# EAGLE design garbageSensor (EAGLE 6.4)
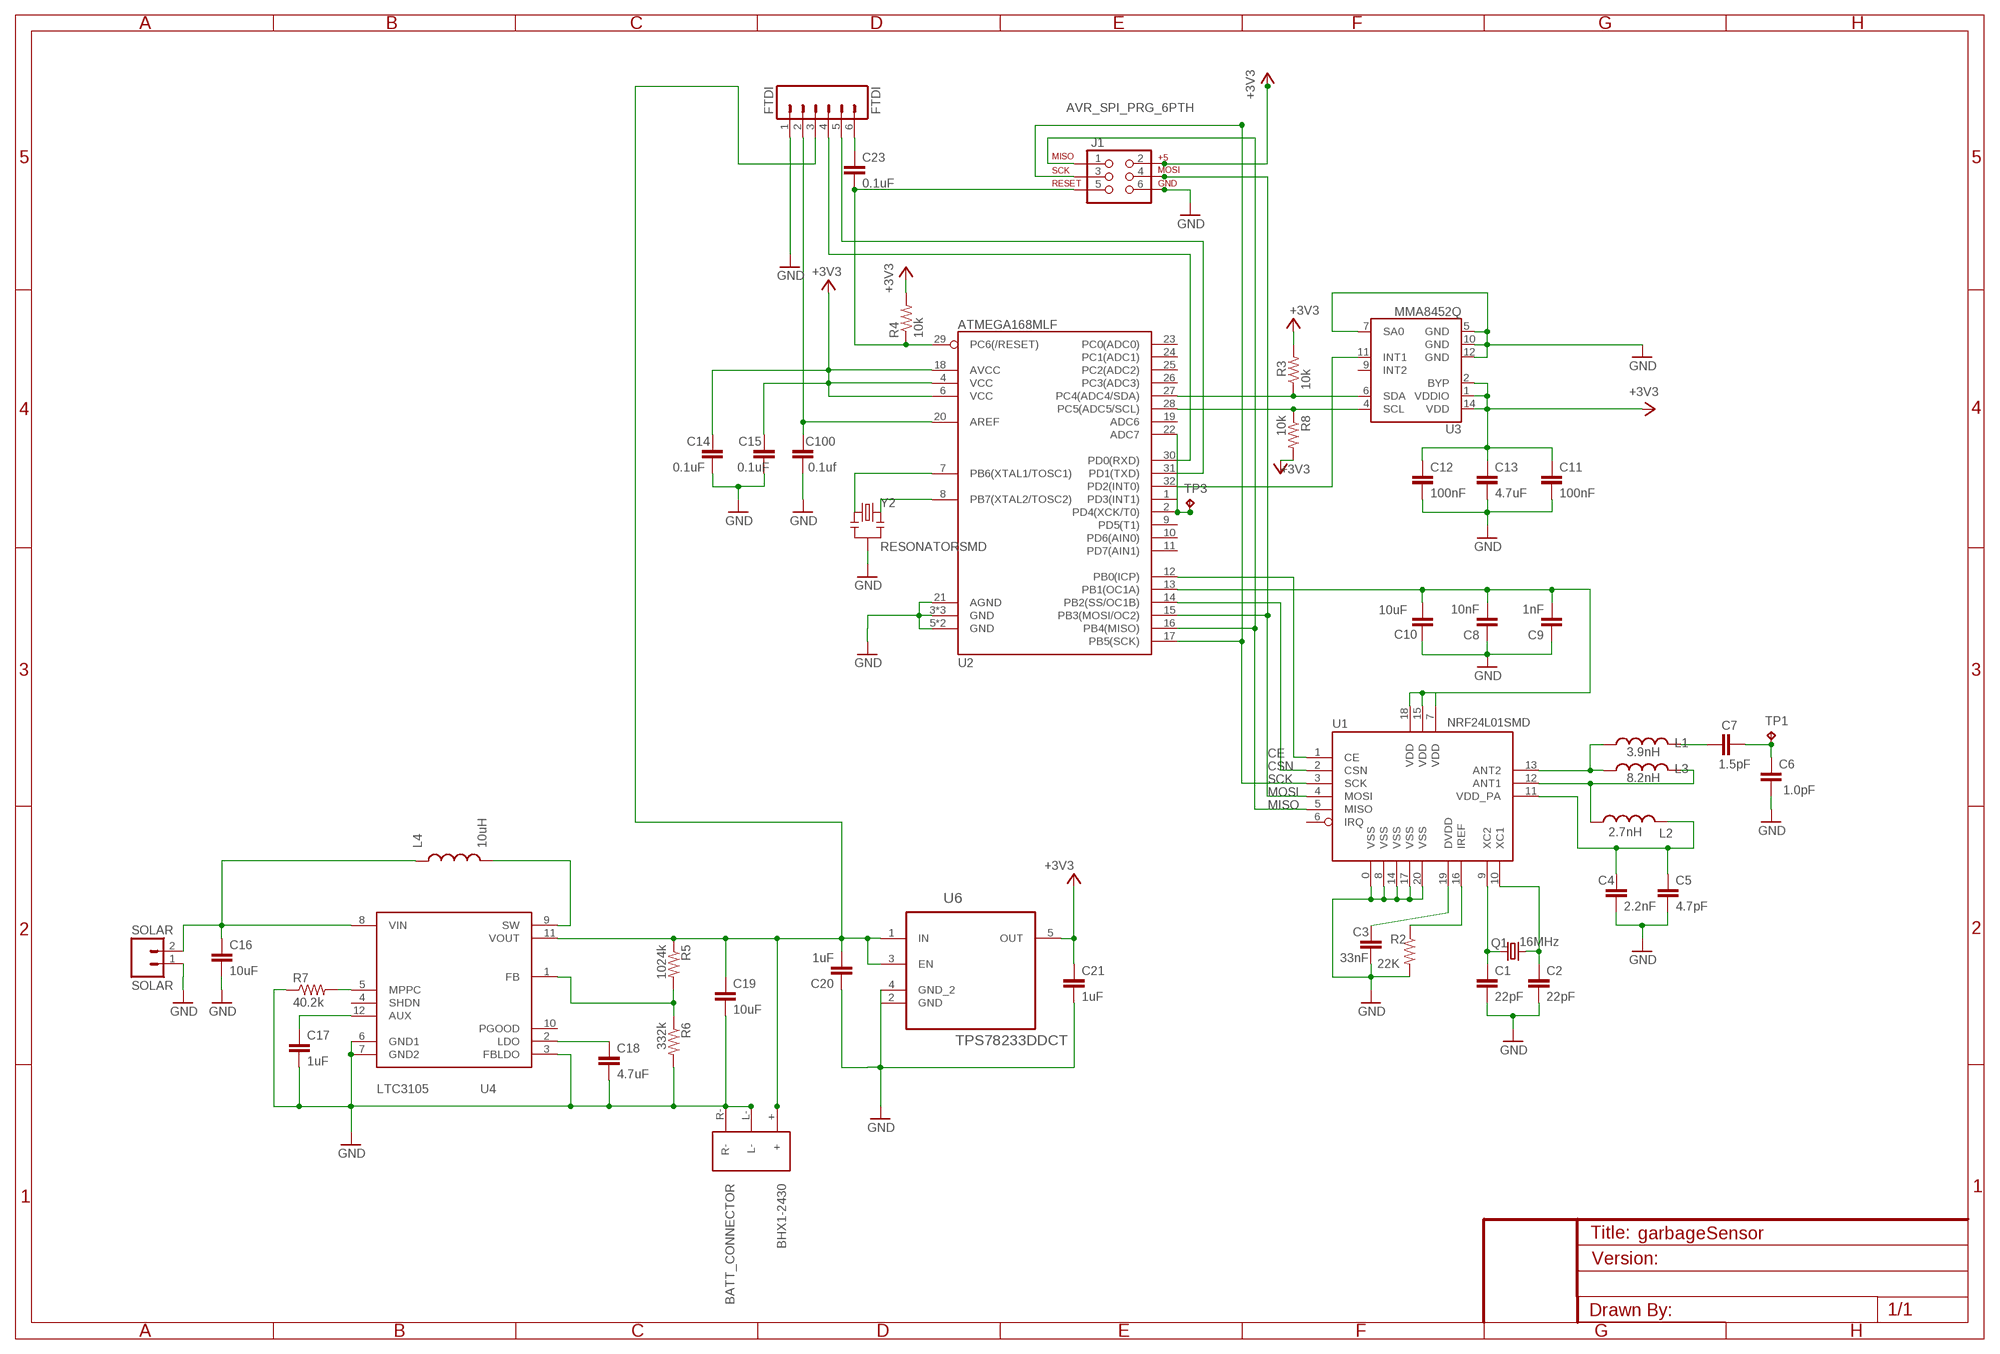
[diagram p0: schematic, sheet 1]

## Parts
B1  BATT_CONNECTOR  BHX1-2325  [BHX1-2325]
C1  22pF  CAP0603  [0603]
C2  22pF  CAP0603  [0603]
C3  33nF  CAP0603  [0603]
C4  2.2nF  CAP0402  [C0402]
C5  4.7pF  CAP0402  [C0402]
C6  1.0pF  CAP0402  [C0402]
C7  1.5pF  CAP0402  [C0402]
C8  10nF  CAP0603  [0603]
C9  1nF  CAP0603  [0603]
C10  10uF  C-EUC0603K  [C0603K]
C11  100nF  C-EUC0603K  [C0603K]
C12  100nF  C-EUC0603K  [C0603K]
C13  4.7uF  C-EUC0603K  [C0603K]
C14  0.1uF  C-EUC0603K  [C0603K]
C15  0.1uF  C-EUC0603K  [C0603K]
C16  10uF  C-EUC0603K  [C0603K]
C17  1uF  C-EUC0603K  [C0603K]
C18  4.7uF  C-EUC0603K  [C0603K]
C19  10uF  C-EUC0603K  [C0603K]
C20  1uF  C-EUC0603K  [C0603K]
C21  1uF  C-EUC0603K  [C0603K]
C23  0.1uF  CAP0603-CAP  [0603-CAP]
C100  0.1uf  CAP0603-CAP  [0603-CAP]
FTDI  FTDI  M06SIP  [1X06]
J1  AVR_SPI_PRG_6PTH  [2X3]
L1  3.9nH  INDUCTOR0402  [C0402]
L2  2.7nH  INDUCTOR0402  [C0402]
L3  8.2nH  INDUCTOR0402  [C0402]
L4  10uH  LQH2  [0806]
Q1  16MHz  CRYSTAL5X3  [CRYSTAL-SMD-5X3]
R2  22K  RESISTOR0603  [0603]
R3  10k  R-US_R0603  [R0603]
R4  10k  R-US_R0603  [R0603]
R5  1024k  R-US_R0603  [R0603]
R6  332k  R-US_R0603  [R0603]
R7  40.2k  R-US_R0603  [R0603]
R8  10k  R-US_R0603  [R0603]
SOLAR  SOLAR  M02LOCK  [1X02_LOCK]
TP1  TPB2,54  [B2,54]
TP3  TPTP06R  [TP06R]
U1  NRF24L01SMD  [QFN20]
U2  ATMEGA168MLF  [MLF32]
U3  MMA8452Q  [QFN-16_0.5MM]
U4  CHARGER  LTC3105  [MSOP-12]
U6  TPS78233DDCT  [SOT95P280X110-5N]
Y2  RESONATORSMD  [RESONATOR-SMD]

## Nets
+3V3: C11.1 C12.1 C13.1 C14.2 C15.2 C21.1 J1.2 R3.2 R4.2 R8.2 U2.4(VCC) U2.6(VCC) U2.18(AVCC) U3.1(VDDIO) U3.2(BYP) U3.14(VDD) U6.5(OUT)
ACCELERO_INTERRUPT: U2.32(PD2(INT0)) U3.11(INT1)
ANT: C6.2 C7.2 TP1.TP
ANTENNA1: L1.1 L3.1 U1.13(ANT2)
ANTENNA2: L2.1 L3.2 U1.12(ANT1)
ANTENNA3: C4.1 C5.1 L2.2 U1.11(VDD_PA)
AREF: C100.1 FTDI.2 U2.20(AREF)
AUX: C17.1 U4.12(AUX)
CE: U1.1(CE) U2.12(PB0(ICP))
CSN: U1.2(CSN) U2.14(PB2(SS/OC1B))
FB: R5.2 R6.1 U4.1(FB)
GND: B1.L- B1.R- C1.2 C2.2 C3.2 C4.2 C5.2 C6.1 C8.1 C9.1 C10.2 C11.2 C12.2 C13.2 C14.1 C15.1 C16.2 C17.2 C18.2 C19.2 C20.1 C21.2 C100.2 FTDI.1 J1.6 R2.2 R6.2 R7.1 SOLAR.1 U1.0(VSS) U1.8(VSS) U1.14(VSS) U1.17(VSS) U1.20(VSS) U2.3(GND) U2.5(GND) U2.21(AGND) U2.GND1(GND) U2.GND2(GND) U2.GND3(GND) U3.5(GND) U3.7(SA0) U3.10(GND) U3.12(GND) U4.3(FBLDO) U4.6(GND1) U4.7(GND2) U6.2(GND) U6.4(GND_2) Y2.2
LDO: C18.1 U4.2(LDO)
MISO: J1.1 U1.5(MISO) U2.16(PB4(MISO))
MOSI: J1.4 U1.4(MOSI) U2.15(PB3(MOSI/OC2))
MPPC: R7.2 U4.5(MPPC)
N$1: C1.1 Q1.1 U1.9(XC2)
N$2: C2.1 Q1.3 U1.10(XC1)
N$4: R2.1 U1.16(IREF)
N$5: C3.1 U1.19(DVDD)
N$6: TP3.TP U2.2(PD4(XCK/T0))
N$7: U2.22(ADC7)
N$9: C7.1 L1.2
N$11: L4.P$2 U4.9(SW)
N$12: C23.1 FTDI.6
RESET: C23.2 J1.5 R4.1 U2.29(PC6(/RESET))
RX: FTDI.4 U2.30(PD0(RXD))
SCK: J1.3 U1.3(SCK) U2.17(PB5(SCK))
SCL: R8.1 U2.28(PC5(ADC5/SCL)) U3.4(SCL)
SDA: R3.1 U2.27(PC4(ADC4/SDA)) U3.6(SDA)
SOLAR: C16.1 L4.P$1 SOLAR.2 U4.8(VIN)
TX: FTDI.5 U2.31(PD1(TXD))
VBATT: B1.+ C19.1 C20.2 FTDI.3 R5.1 U4.11(VOUT) U6.1(IN) U6.3(EN)
WIRELESS_POWER_LINE: C8.2 C9.2 C10.1 U1.7(VDD) U1.15(VDD) U1.18(VDD) U2.13(PB1(OC1A))
XTAL1: U2.7(PB6(XTAL1/TOSC1)) Y2.1
XTAL2: U2.8(PB7(XTAL2/TOSC2)) Y2.3
Unconnected: U1.6(IRQ) U2.1(PD3(INT1)) U2.9(PD5(T1)) U2.10(PD6(AIN0)) U2.11(PD7(AIN1)) U2.19(ADC6) U2.23(PC0(ADC0)) U2.24(PC1(ADC1)) U2.25(PC2(ADC2)) U2.26(PC3(ADC3)) U3.9(INT2) U4.4(SHDN) U4.10(PGOOD)

## Library data of the parts
B1 = CONNECTORS:BHX1-2325: coin cell battery holder. For 24mm cells with through hole integration. Has glider for positive and metal for ground; MOUNTING: Through hole; SIZE: 24.5mm
C1-C9 = SparkFun:CAP: Capacitor Standard 0603 ceramic capacitor, and 0.1" leaded capacitor.
C10-C21 = resistor:C-EU: CAPACITOR, European symbol
C23 C100 = SparkFun-Capacitors:CAP: Capacitor Standard 0603 ceramic capacitor, and 0.1" leaded capacitor.
FTDI = SparkFun-Connectors:M06: Header 6 Standard 6-pin 0.1" header. Use with straight break away headers (SKU : PRT-00116), right angle break away headers (PRT-00553), swiss pins (PRT-00743), machine pins (PRT-00117), and female headers (PRT-00115). Molex polarized connector foot print use with SKU : PRT-08094 with associated crimp pins and housings. NOTES ON THE VARIANTS LOCK and LOCK_LONGPADS... This footprint was designed to help hold the alignment of a through-hole component (i.e. 6-pin header) while soldering it into place. You may notice that each hole has been shifted either up or down by 0.005 of an inch from it's more standard position (which is a perfectly straight line). This slight alteration caused the pins (the squares in the middle) to touch the edges of the holes. Because they are alternating, it causes a "brace" to hold the component in place. 0.005 has proven to be the perfect amount of "off-center" position when using our standard breakaway headers. Although looks a little odd when you look at the bare footprint, once you have a header in there, the alteration is very hard to notice. Also, if you push a header all the way into place, it is covered up entirely on the bottom side. This idea of altering the position of holes to aid alignment will be further integrated into the Sparkfun Library for other footprints. It can help hold any component with 3 or more connection pins.
J1 = SparkFun-Connectors:AVR_SPI_PRG_6: AVR ISP 6 Pin This is the reduced ISP connector for AVR programming. Common on Arduino. This footprint will take up less PCB space and can be used with a 10-pin to 6-pin adapter such as SKU: BOB-08508
L1-L3 = SparkFun:INDUCTOR: Inductors Basic Inductor/Choke - 0603 and 1206. Footprints are not proven and vary greatly between part numbers.
L4 = INDUCTORS:LQH2
Q1 = SparkFun:CRYSTAL: Crystals Various standard crystals. Proven footprints. Spark Fun Electronics SKU : COM-00534
R2 = SparkFun:RESISTOR: Resistor Basic schematic elements and footprints for 0603, 1206, and PTH 1/10th watt (small) resistors.
R3-R8 = resistor:R-US_: RESISTOR, American symbol
SOLAR = SparkFun-Connectors:M02: Header 2 Standard 2-pin 0.1" header. Use with straight break away headers (SKU : PRT-00116), right angle break away headers (PRT-00553), swiss pins (PRT-00743), machine pins (PRT-00117), and female headers (PRT-00115). Molex polarized connector foot print use with SKU : PRT-08233 with associated crimp pins and housings.
TP1 TP3 = testpad:TP: Test pad
U1 = SparkFun-RF:NRF24L01: 2.4GHz Low Power Transceiver This is the very popular, low cost, very low power RF transceiver from Nordic Semiconductor. Simple SPI interface. SKU: COM-00690
U2 = SparkFun-DigitalIC:ATMEGA168: Atmel 32-pin 8-bit micro, 16k flash.
U3 = SparkFun-Sensors:MMA8452Q: MMA8452Q 3-Axis, 12/8-bit Digital Accelerometer Supply Voltage: 1.6-3.6V Range: +/- 2g, 4g, 8g Interface: I2C, 12-bit and 8-bit ODR: 1.56 Hz - 800 Hz Package: QFN-16 http://cache.freescale.com/files/sensors/doc/data_sheet/MMA8452Q.pdf; PROD_ID: IC-10769
U4 = DC-DC_CONVERTERS:LTC3105
U6 = LDO:TPS78233DDCT: Low-Dropout Linear Regulator; MPN: TPS78233DDCT; OC_FARNELL: 1710835; OC_NEWARK: 45P8307; PACKAGE: TSOT-23-5; SUPPLIER: Texas Instruments
Y2 = SparkFun-FreqCtrl:RESONATOR: Resonator Small SMD resonator. This is the itty bitty 10/20MHz resonators with built in caps. CSTCE10M0G55 and CSTCE20M0V53. Footprint has been reviewed closely but hasn't been tested yet.

## Board
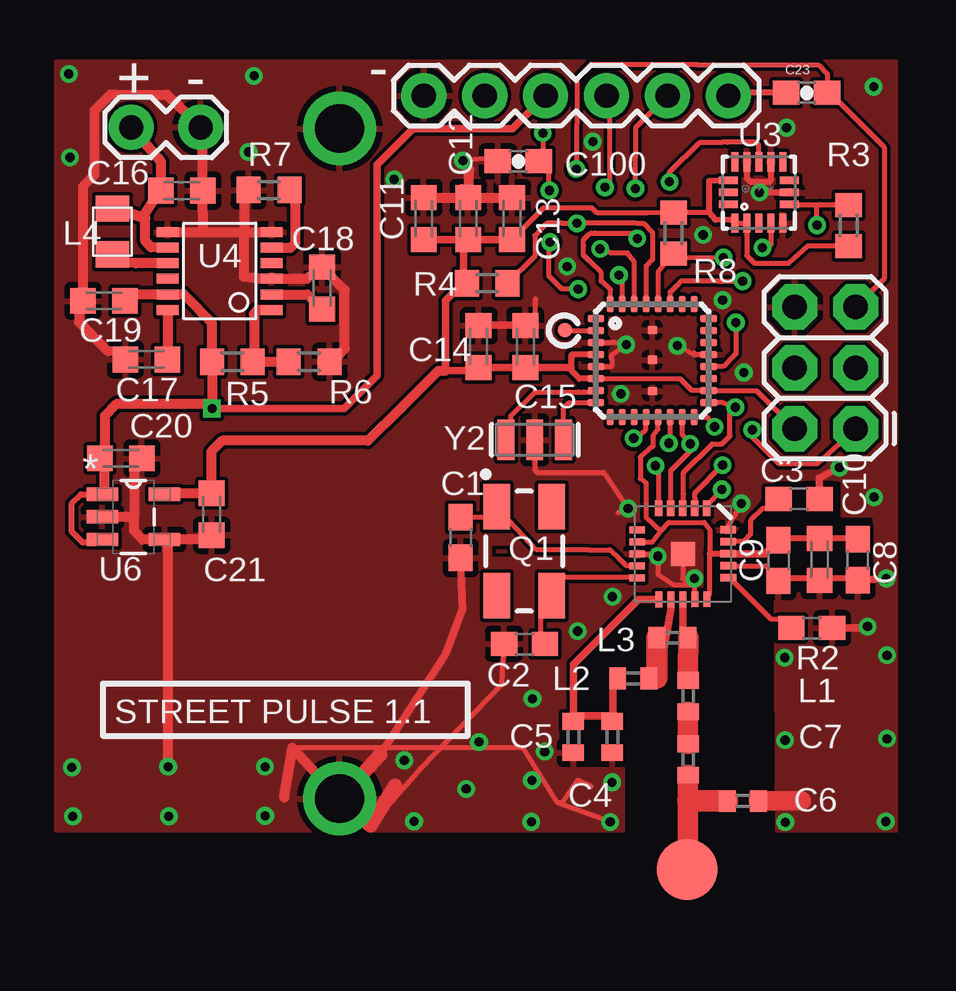
[diagram p1: board, top side]
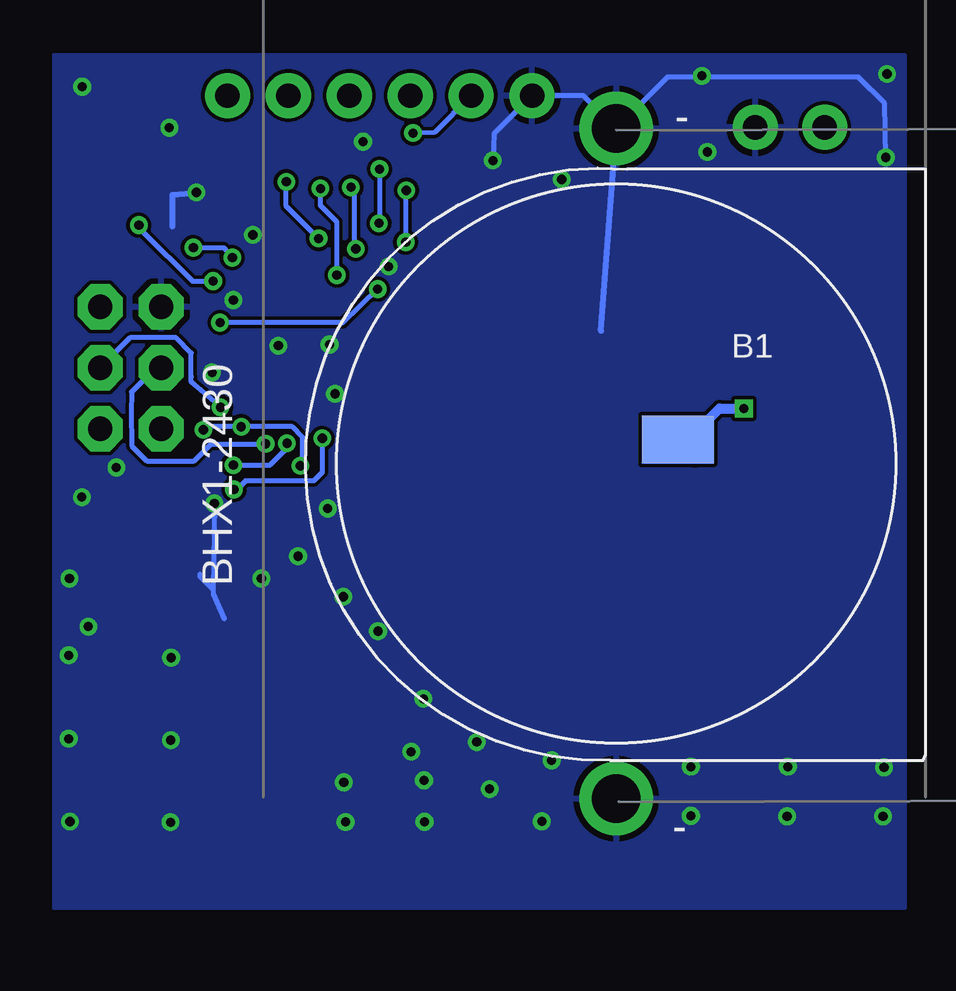
[diagram p2: board, bottom side, seen from below]

No outline drawn. Coordinates in mm, seen from the top.
Copper layers (1*16): Top 0.0356mm / dielectric 1.5011mm / Bottom 0.0356mm
Design rules "default": minimum track width 6mil, minimum drill 15mil, track to track 6mil, track to pad 6mil, pad to pad 6mil, via to via 6mil, smd to smd 6mil, copper to edge 15mil, drill to drill 6mil, minimum pad ring 7mil, minimum via ring 7mil, stop-mask expansion 4mil, vias tented up to drill 20mil, thermal gap 10mil

### Footprints (pad centres in the part's own frame; a part is rotated, then mirrored left to right if it is on the bottom)
BHX1-2325 = smd 2 x 3: + 1,-2.58 | drill 2.032: L- -13.97,0; R- 13.97,0
0603 = smd 1.1 x 1: 1 -0.85,0; 2 0.85,0
C0402 = smd 0.7 x 0.9: 1 -0.65,0; 2 0.65,0
C0603K = smd 1.05 x 1.08: 1 -0.875,0; 2 0.875,0
0603-CAP = smd 1.1 x 1: 1 -0.85,0; 2 0.85,0
1X06 = drill 1.016 pad 1.88: 1 0,0; 2 2.54,0; 3 5.08,0; 4 7.62,0; 5 10.16,0; 6 12.7,0
2X3 = drill 1.016 pad 1.88 octagon: 1 0,0; 2 0,2.54; 3 2.54,0; 4 2.54,2.54; 5 5.08,0; 6 5.08,2.54
0806 = smd 1.1 x 1.4: P$1 -0.95,0; P$2 0.95,0
CRYSTAL-SMD-5X3 = smd 1.9 x 1.1: 1 -1.85,-1.15; 2 1.85,-1.15; 3 1.85,1.15; 4 -1.85,1.15
R0603 = smd 1 x 1.1: 1 -0.85,0; 2 0.85,0
1X02_LOCK = drill 1.016 pad 1.88: 1 -0.178,0; 2 2.718,0
B2,54 = smd 2.54 x 2.54: TP 0,0
TP06R = smd 0.6 x 0.6: TP 0,0
QFN20 = smd 1 x 1: 0 0,0 | smd 0.65 x 0.3: 1 -1.9,1; 2 -1.9,0.5; 3 -1.9,0; 4 -1.9,-0.5; 5 -1.9,-1; 11 1.9,-1; 12 1.9,-0.5; 13 1.9,0; 14 1.9,0.5; 15 1.9,1 | smd 0.3 x 0.65: 6 -1,-1.9; 7 -0.5,-1.9; 8 0,-1.9; 9 0.5,-1.9; 10 1,-1.9; 16 1,1.9; 17 0.5,1.9; 18 0,1.9; 19 -0.5,1.9; 20 -1,1.9
MLF32 = smd 0.7 x 0.3: 1 -2.35,1.75; 2 -2.35,1.25; 3 -2.35,0.75; 4 -2.35,0.25; 5 -2.35,-0.25; 6 -2.35,-0.75; 7 -2.35,-1.25; 8 -2.35,-1.75; 17 2.35,-1.75; 18 2.35,-1.25; 19 2.35,-0.75; 20 2.35,-0.25; 21 2.35,0.25; 22 2.35,0.75; 23 2.35,1.25; 24 2.35,1.75 | smd 0.3 x 0.7: 9 -1.75,-2.35; 10 -1.25,-2.35; 11 -0.75,-2.35; 12 -0.25,-2.35; 13 0.25,-2.35; 14 0.75,-2.35; 15 1.25,-2.35; 16 1.75,-2.35; 25 1.75,2.35; 26 1.25,2.35; 27 0.75,2.35; 28 0.25,2.35; 29 -0.25,2.35; 30 -0.75,2.35; 31 -1.25,2.35; 32 -1.75,2.35 | smd 0.37 x 0.35: GND1 0,0.025; GND2 0,1.27; GND3 0,-1.27
QFN-16_0.5MM = smd 0.8 x 0.3: 1 -1.275,1; 2 -1.275,0.5; 3 -1.275,0; 4 -1.275,-0.5; 5 -1.275,-1; 9 1.275,-1; 10 1.275,-0.5; 11 1.275,0; 12 1.275,0.5; 13 1.275,1 | smd 0.3 x 0.8: 6 -0.5,-1.275; 7 0,-1.275; 8 0.5,-1.275; 14 0.5,1.275; 15 0,1.275; 16 -0.5,1.275
MSOP-12 = smd 0.42 x 0.9: 1 -1.625,-2.165; 2 -0.975,-2.165; 3 -0.325,-2.165; 4 0.325,-2.165; 5 0.975,-2.165; 6 1.625,-2.165; 7 1.625,2.165; 8 0.975,2.165; 9 0.325,2.165; 10 -0.325,2.165; 11 -0.975,2.165; 12 -1.625,2.165
SOT95P280X110-5N = smd 1.321 x 0.559: 1 -1.295,0.94; 2 -1.295,0; 3 -1.295,-0.94; 4 1.295,-0.94; 5 1.295,0.94
RESONATOR-SMD = smd 0.7 x 1.7: 1 -1.2,0; 2 0,0; 3 1.2,0

### Placement (x,y rotation side)
B1  12.26,18.71 90 bottom
C1  17.3,15.63 270 top
C2  19.97,11.19 180 top
C3  31.41,17.24 0 top
C4  23.62,7.31 270 top
C5  22,7.31 270 top
C6  29.07,4.65 180 top
C7  26.78,6.37 270 top
C8  33.85,14.7 90 top
C9  30.55,14.67 90 top
C10  32.26,14.71 270 top
C11  15.76,28.92 90 top
C12  17.62,28.92 90 top
C13  19.45,28.92 90 top
C14  18.05,23.58 270 top
C15  20,23.59 270 top
C16  5.68,30.09 0 top
C17  4.21,23.05 180 top
C18  11.52,26.03 90 top
C19  2.43,25.49 180 top
C20  3.14,18.93 180 top
C21  6.92,16.6 270 top
C23  31.72,34.16 0 top
C100  19.71,31.31 180 top
FTDI  15.76,34.05 0 top
J1  33.77,20.16 90 top
L1  26.78,9.02 270 top
L2  24.49,9.75 180 top
L3  26.14,11.45 180 top
L4  2.78,28.39 270 top
Q1  19.95,15.06 270 top
R2  31.94,11.85 0 top
R3  33.48,28.63 270 top
R4  18.41,26.23 180 top
R5  7.79,22.95 0 top
R6  10.99,22.95 0 top
R7  9.31,30.11 0 top
R8  26.18,28.31 90 top
SOLAR  6.29,32.72 180 top
TP1  26.75,1.78 0 top
TP3  21.64,24.28 0 top
U1  26.56,14.95 270.1 top
U2  25.29,23 0 top
U3  29.73,30.01 90 top
U4  7.25,26.74 90 top
U6  3.66,16.48 0 top
Y2  20.39,19.7 0 top

### Tracks (layer width: path | path; a pad name or v marks a point on that pad's centre or on a via)
+3V3
  Top 0.203: U3.1 U3.2 29.23,28.24 29.23,27.38 29.57,27.05 30.96,27.05 31.77,27.79 R3.2 | U2.6 23.19,22.28 23.16,22.25 26.44,22.25 26.92,21.77 27.62,21.77 | 27.62,21.77 U2.18 | 27.62,21.77 U2.18 | 27.65,29.2 26.34,29.2 R8.2 25.91,29.16 25.09,29.16 22.99,29.16 22.78,29.36 20.75,29.36 20.26,28.86 C13.1 | 27.94,28.86 27.93,28.86 | 27.62,21.77 U2.18 | U2.18 29.64,21.75 J1.2
  Top 0.254: U3.14 27.65,30.49 27.65,30.43 27.65,30.33 27.65,29.87 27.65,29.2 27.93,28.86 28.56,28.87 28.7,28.87 U3.1 | U2.4 21.92,23.25 | 21.92,23.25 21.91,22.72 | U2.6 22.25,22.25 21.92,22.58 21.92,23.25
  Top 0.305: C12.1 C11.1 15.76,28.22 | C12.1 C13.1 | C12.1 17.41,27.94 17.41,26.37 R4.2 17.36,26.2 16.66,25.5 16.66,22.58 18.05,22.58 | C14.2 C15.2 | C15.2 19.98,22.7 | 21.91,22.72 C15.2 | 16.38,22.58 16.39,22.58
  Top 0.406: C14.2 18.05,22.58 | 20.02,22.73 C15.2 | 16.66,22.58 16.39,22.58 14.82,21.02 13.44,19.66 7.37,19.66 6.91,19.2 C21.1 5,17.48 U6.5
ACCELERO_INTERRUPT  (via drill 0.38)
  Top 0.203: U3.11 29.73,31.99 29.62,32.11 28.42,32.11 28.19,32.11 27.28,32.11 26.01,30.86 v26.01,30.45 | U2.32 23.55,25.95 23.16,26.31 23.16,26.67 22.66,27.18 22.43,27.41 22.43,27.79 22.43,28.04 22.66,28.27 22.73,28.32 22.91,28.32 24.49,28.32 24.54,28.22 v24.66,28.09
  Bottom 0.203: v24.66,28.09 26.01,29.44 v26.01,30.45
ANT
  Top 0.203: 26.77,1.73 26.95,1.73 TP1.TP
  Top 0.864: 26.77,1.73 26.77,4.65 26.78,4.66 C7.2
  Top 0.889: C6.2 26.98,4.65 26.77,4.65
ANTENNA1
  Top 0.305: U1.13 26.57,11.89 26.57,11.45 L3.1
  Top 0.61: L1.1 26.78,10.11
  Top 0.864: 26.78,10.11 L3.1
ANTENNA2
  Top 0.203: 25.49,9.77 L2.1 | 25.78,11.01 L3.2
  Top 0.305: U1.12 26.06,12.63 26.06,12.62 25.78,11.01
  Top 0.889: L3.2 25.49,9.77
ANTENNA3
  Top 0.203: 21.96,7.86 C5.1 | 22,7.88 C5.1 | 23.65,8.18 C4.1 | 22.02,8.18 C5.1 | 23.65,9.7 L2.2
  Top 0.305: U1.11 24.98,13.04 24.7,13.04 22,10.34 22,7.88 | 22.02,8.18 23.65,8.18 23.65,9.7
AREF  (via drill 0.38)
  Top 0.203: v20.73,32.49 20.73,32.2 20.73,31.75 C100.1 20.98,30.92 20.98,30.79 20.98,30.18 v21.01,30.1 | 27.61,22.78 U2.20 | U2.20 28.25,22.76 28.7,23.21 28.78,23.29 v28.78,24.58 | v22.2,25.98 21.51,25.98 20.98,26.52 20.98,27.89 v21.03,27.94
  Top 0.254: U2.20
  Bottom 0.203: FTDI.2 19.84,32.51 v20.73,32.49 | v22.2,25.98 23.65,24.58 v28.78,24.58 | v21.01,30.1 21.03,30.05 v21.03,27.94
AUX
  Top 0.406: U4.12 5.09,23.81 C17.1
CE  (via drill 0.38)
  Top 0.203: 27.55,16.94 U1.1 27.57,16.9 27.58,16.96 v28.19,17.63 | U2.12 25.04,20.41 24.99,20.37 24.99,20.09 24.66,19.79 24.51,19.94 v24.51,19.76
  Bottom 0.203: v24.51,19.76 24.51,18.34 24.87,17.98 27.71,17.98 27.96,17.73 v28.19,17.63
CSN  (via drill 0.38)
  Top 0.203: v25.98,19.56 26.04,19.79 U2.14 | U1.2 27.05,17.12 27.05,17.15 | 27.08,16.87 U1.2 | U1.2 27.05,17.3 27.05,17.48 v28.22,18.64
  Bottom 0.203: v28.22,18.64 26.7,18.64 25.98,19.36 v25.98,19.56
EMPTY
  pour Top (isolate 1.676): 11.33,23.75 11.2,26.16 10.9,27.25 9.86,29.54 8.89,29.54 6.3,29.59 6.3,32.99 3.23,32.99 3.25,29.64 2.51,29.59 2.51,24.49 3.23,23.77
EMPTY3
  pour Top (isolate 0.813): 18.85,17.09 20.93,17.09 20.95,14.68 23.6,14.68 24.1,14.53 20.62,14.53 20.7,12.22 18.85,12.22
  pour Top (isolate 0.813): 2.03,15.82 1.98,16.08 2.9,16.08 2.9,18.87 4.11,18.87 4.14,18.67 4.14,16 6.73,16.03 6.88,15.77
  pour Top (isolate 0.305): 5.08,14.88 5.1,6.36 5.28,6.27 5.31,6.05 5.28,5.84 4.9,5.84 4.9,6.17 5.08,6.17
EMPTY4
  pour Top (isolate 0.406): 30.61,12.17 33.2,12.17 33.2,11.53 30.61,11.53
FB
  Top 0.406: U4.1 8.81,25.12 8.69,24.94 8.69,23 R5.2 R6.1
GND  (via drill 0.38)
  Top 0.203: 30.96,13.94 C9.1 30.05,14.45 28.98,14.45 U1.17 | U1.8 25.32,14.94 25.53,14.73 25.53,14.1 26.19,13.64 26.9,13.64 | 26.9,13.64 26.75,13.79 27.05,13.59 U1.14 | U2.3 23.52,23.75 23.72,23.75 v24.21,23.67 23.6,23.24 23.62,22.96 23.62,22.78 23.54,22.75 U2.5 | U2.21 27.09,23.25 27.03,23.32 27.03,23.24 v26.34,23.62 | 28.45,15.96 U1.20 28.46,16.11 v29.01,17.04 | 34.44,13.88 C8.1 | 34.18,11.85 v34.26,11.92 | C2.2 19.03,9.53 15.65,6.03 13.55,3.62 | U1.0 26.56,13.9 26.9,13.64 | Y2.2 20.39,18.45 20.5,18.34 23.27,18.34 v24.28,16.84 23.88,16.66 | C100.2 18.52,31.45 v17.4,31.34 | 20.17,24.64 20.19,24.64 20.42,24.87 20.42,25.58 | v23.54,3.77 21.34,4.57 | 21.34,4.57 19.91,6.87 10.29,6.87 | 22.74,5.24 22.16,5.5 21.52,4.57 21.34,4.57 | 34.52,13.88 35.03,13.88 v35.05,13.92
  Top 0.254: U3.10 30.23,30.51 30.19,30.47 29.68,30.47 | U3.12 29.23,30.61 29.38,30.47 29.68,30.47 | 29.68,30.47 v29.76,30.01 29.78,30.01 U3.7 | C8.1 34.14,13.93 32.38,13.93 32.1,13.94 C10.2 32.44,13.94 30.96,13.94 | 20.17,24.64 C15.1
  Top 0.305: C15.1 19.94,24.49 18.08,24.49 C14.1 | R2.2 34.18,11.85 | C1.2 17.37,12.65 16.66,10.74 13.95,6.56 | v33.1,18.54 32.26,18.11 C3.2 | 34.44,13.88 34.52,13.88
  Top 0.406: 8.27,28.36 U4.7 6.57,28.37 C16.2 6.54,31.09 6.54,32.47 SOLAR.1 5.05,34.09 2.9,34.09 2.69,34.09 2.03,33.43 2.03,30.73 1.55,30.25 C19.2 | 8.27,28.36 U4.6 | 8.27,28.36 8.27,28.26 8.27,26.48 8.85,26.41 U4.3 10.88,26.41 C18.2 12.47,25.95 12.47,23.5 12.09,23.11 R6.2 | C11.2 C12.2 | C12.2 C13.2 | C17.2 3.1,23.29 3.1,23.39 2.61,23.38 1.4,24.61 1.4,25 C19.2 | R7.1 8.28,29.92 8.28,28.37 8.27,28.36 | C19.2 1.37,25.67 | 9.94,4.79 10.29,6.87 B1.L- | C12.2 17.62,29.88 17.35,30.15 17.65,30.15 17.65,30.96 v17.4,31.34 | 3.68,16.48 U6.2 | C20.1 3.68,18.41 3.68,16.48 | U6.4 5.08,15.42 5.08,6.1 v5.11,6.07 | C21.2 6.74,15.54 U6.4 | U6.4 4.04,15.54 3.68,15.9 3.68,16.48
  Top 0.61: 14.56,5.28 13.55,3.62 B1.L- 13.95,6.56
  Top 0.813: C6.1 31.49,4.65
  Bottom 0.203: v17.4,31.34 17.35,32.46 FTDI.1 13.62,34.05 B1.R- 10.11,34.82 2.16,34.82 1.07,33.73 v1.02,31.47 | J1.6 31.61,25.63 | 29.06,13.46 v29.01,17.04 29.06,16.54 | 29.06,13.46 29.06,13.28 28.6,12.24 | 29.62,14.1 29.62,14.02 29.06,13.46
  Bottom 0.254: 30.75,28.59 30.75,29.91 v29.76,30.01 | 12.89,24.25 B1.R-
  other vias: 23.61,5.42 30.82,7.18 21.74,26.92 23.98,21.62 29.11,22.5 22.81,32.13 27.41,28.24 14.95,6.34 34.53,17.31 18.07,7.1 22.18,11.72 17.53,5.14 20.25,3.77 20.27,5.5 20.8,6.7 20.3,8.91 23.64,13.16 30.84,3.76 35.08,10.72 35.08,7.24 35.03,3.78 8.46,31.7 15.36,3.8 25.52,14.85 30.89,32.72 1.13,4 5.13,4 9.15,4.03 9.14,6.07 30.81,10.62 34.52,34.42 0.97,34.95 8.69,34.87 27.05,13.92 14.53,30.56 28.22,25.53 1.09,6.05
  pour Bottom: 0.23,35.71 35.69,35.71 35.69,0.2 0.23,0.2
  pour Top (isolate 0.152, rank 2): 0.41,35.53 35.48,35.53 35.48,3.35 30.45,3.35 30.4,13.31 34.54,13.31 34.52,16.28 34.52,16.48 33.2,16.48 33.2,17.98 32.99,17.98 30.38,18.01 28.68,15.77 25.7,13.08 24.46,13.08 23.44,12.06 22.1,10.41 22.1,8.23 21.51,8.23 21.56,7.59 21.36,7.59 21.36,7.14 21.51,7.11 21.51,6.35 22.56,6.35 22.48,6.02 23.16,6.02 23.14,6.32 24.1,6.32 24.1,3.35 0.41,3.35
  pour Top (no thermals): 26.14,15.85 26.14,15.77 25.53,15.09 25.5,13.94 25.91,13.94 26.19,13.67 26.9,13.64 27.38,13.64 27.43,15.37 26.85,15.9 26.19,15.9
LDO
  Top 0.406: U4.2 10.91,25.76 C18.1
MISO  (via drill 0.38)
  Top 0.203: U2.16 27.56,20.65 v27.89,20.24 | U1.5 25.55,18.51 v25.43,18.62 | J1.1 32.18,18.71 31.06,18.69 30.58,18.69 29.44,19.84 v29.46,20.12
  Bottom 0.203: v29.46,20.12 29.34,20.24 28.91,20.24 v27.89,20.24 25.76,20.24 25.32,19.81 25.32,19.1 25.32,18.62 v25.43,18.62
MOSI  (via drill 0.38)
  Top 0.203: U1.4 26.06,16.89 26.06,18.41 26.85,19.2 v26.87,19.53 26.54,19.92 U2.15
  Bottom 0.203: v26.87,19.53 29.13,19.53 29.84,18.82 31.83,18.82 32.45,19.45 32.45,19.53 32.47,20.82 32.46,21.69 31.78,22.35
  Bottom 0.254: 31.78,22.35 J1.4
MPPC
  Top 0.406: U4.5 10.21,27.71 10.41,27.91 10.41,29.86 R7.2
N$1
  Top 0.203: 18.91,17.57 19.09,17.57 | U1.9 24.22,14.44 23.93,14.73 23.52,15.11 22.63,15.11 20.47,15.11 Q1.1 18.8,16.41 18.62,16.23 18.37,16.48 C1.1
  Top 0.254: 18.78,17.19 Q1.1 18.91,17.56 18.91,17.57 18.73,17.19
N$2
  Top 0.203: U1.10 24.44,13.89 24.43,13.97 22.96,13.97 21.52,13.97 21.43,13.88 21.11,13.94 | C2.1 20.44,11.34 20.65,11.66 20.65,12.27 20.78,12.5 20.78,12.88 Q1.3
  Top 0.254: 20.86,13.77 20.94,13.59 20.99,13.82 | 20.99,13.82 Q1.3 | 21.11,13.94 20.99,13.82
N$4
  Top 0.203: U1.16 28.52,13.95 29.69,12.78 30.23,12.24 30.63,12.24 31.03,11.85 R2.1
N$5
  Top 0.203: U1.19 28.5,15.49 | U1.19 | C3.1 30.96,17.24 30.56,16.84 29.9,16.84 29.39,16.33 29.39,15.77 29.08,15.47 28.48,15.47 U1.19
N$6
  Top 0.203: TP3.TP 21.67,24.25 U2.2
N$9
  Top 0.864: C7.1 L1.2
N$11
  Top 0.406: U4.9 3.77,27.06 3.09,27.09 3.14,27.19 2.56,27.19 L4.P$2
N$12
  Top 0.254: C23.1 28.58,34.16 FTDI.6
RESET  (via drill 0.38)
  Top 0.203: v22.12,30.99 22.15,34.75 22.71,35.33 27.18,35.33 32.21,35.33 32.59,34.95 32.59,34.18 C23.2 32.69,34.16 34.98,31.88 34.98,26.44 J1.5 | 19.35,26.23 R4.1 20.4,27.36 20.4,28.22 20.88,28.73 21.54,28.73 v22.15,28.73 24.64,28.73 24.77,28.73 24.92,28.73 25.3,28.35 25.3,27.2 25.04,26.94 U2.29
  Top 0.254: J1.5
  Bottom 0.203: v22.12,30.99 22.12,28.98 22.12,28.88 22.15,28.88 v22.15,28.73
RX  (via drill 0.38)
  Top 0.203: 23.39,33.83 FTDI.4 23.52,33.91 23.52,30.4 23.34,30.23 v23.32,30.23 | U2.30 24.54,27.13 24.26,27.48 23.57,27.48 v23.11,27.66
  Bottom 0.203: v23.11,27.66 23.22,27.66 23.16,27.89 23.16,29.87 23.14,30.23 v23.32,30.23
SCK  (via drill 0.38)
  Top 0.203: U2.17 27.68,21.21 27.94,21.21 | 27.73,21.26 U2.17 | U2.17 28.19,21.26 v28.75,21.06 28.52,20.85 28.52,19.86 28.19,19.53 27.79,19.53 26.59,18.34 26.59,17.45 26.59,16.89 U1.3 | U1.3 26.55,17.11 | U1.3 26.54,16.86 U1.3
  Bottom 0.203: v28.75,21.06 29.97,22.1 29.97,22.33 29.97,23.32 30.61,23.95 32.52,23.95 J1.3
SCL  (via drill 0.38)
  Top 0.203: U3.4 30.23,27.82 v29.89,27.71 | U2.28 25.54,26.25 25.54,26.7 R8.1 25.91,27.31 v28.26,27.3
  Bottom 0.203: v29.89,27.71 29.51,27.7 28.62,27.7 v28.26,27.3
SDA  (via drill 0.38)
  Top 0.203: U2.27 26.04,25.86 26.29,26.11 26.49,26.31 28.04,26.31 v29.06,26.31 | U3.6 32.26,29.51 | 32.26,29.51 32.92,29.51 R3.1 | R3.1 | 33.38,29.58 R3.1 | v32.16,28.65 32.16,29.41 32.26,29.51
  Bottom 0.203: v32.16,28.65 32,28.5 32,28.37 29.92,26.31 v29.06,26.31
SOLAR
  Top 0.203: 4.51,29.68 4.51,29.8 C16.1
  Top 0.406: U4.8 4.38,27.73 4.15,27.98 4.15,28.94 3.02,29.34 2.78,29.13 L4.P$1 4.03,28.97 4.51,29.68 | SOLAR.2 4.8,31.31 C16.1
TX  (via drill 0.38)
  Top 0.203: 24.05,25.37 U2.31 24.04,26.46 v23.9,26.57 | v24.59,30.18 24.61,32.74 FTDI.5
  Bottom 0.203: v23.9,26.57 23.9,28.78 24.59,29.46 v24.59,30.18
VBATT  (via drill 0.38)
  Top 0.254: U6.3 2.23,15.42 1.55,15.42 1.09,15.88 1.09,17.04 1.47,17.42 U6.1
  Top 0.305: FTDI.3 19.46,32.66 15.32,32.66 13.82,31.17 13.82,30.76 13.82,29.95 13.82,29.92 13.82,27.61 13.82,24.92 13.82,22.91 13.82,22.38 12.45,21.01 12.39,21.01 v6.93,21.01
  Top 0.406: C19.1 3.57,25.76 4.37,25.76 U4.11 5.12,25.76 5.77,25.76 6.94,24.56 R5.1 v6.93,21.01 6.73,21.21 2.97,21.21 2.46,20.7 2.46,19.13 C20.2 2.46,18.73 2.46,17.52 2.38,17.45 U6.1 2.34,17.45
  Bottom 0.406: 8.99,19 8.43,19 8.43,20.52 7.95,21.01 v6.93,21.01
  Bottom 0.61: B1.+ 8.99,19
WIRELESS_POWER_LINE
  Top 0.203: U1.7 25.3,15.44 25.65,15.9 | 25.65,15.9 25.98,16.26 27.46,16.26 27.69,15.95 27.69,15.19 27.69,14.96 27.69,13.31 U1.15 | 25.65,15.9 25.04,16.46 25.04,17.91 24.79,18.09 24.79,18.97 25.32,19.43 25.32,19.89 25.53,20.14 25.53,20.64 U2.13 | 30.84,15.44 C9.2 | 30.75,15.41 C9.2 | 30.62,15.28 C9.2
  Top 0.254: 32.11,15.59 C10.1 32.55,15.63 32.11,15.59 | 32.11,15.59 30.8,15.59 30.69,15.43 30.75,15.41 C9.2 | 32.11,15.59 32.12,15.61 33.95,15.61 C8.2 | 27.69,14.96 28.45,14.96 U1.18
  Top 0.305: U1.18 29.98,14.95 C9.2
XTAL1
  Top 0.203: 22.92,21.77 U2.7 22.88,21.69 22.43,21.69 22.17,21.69 20.4,21.69 19.38,20.7 19.38,20.14 Y2.1
XTAL2
  Top 0.203: Y2.3 21.59,20.78 21.59,21.02 21.82,21.25 U2.8

### Text on the board
_tsilk: + | - | - | STREET PULSE 1.1